# Altium schematic sheet RBB_MCU7_V2.2_MCU.SchDoc: <Project Name>
size A3; ApprovedBy: <Appr.>; Author: <Author>; CompanyName: Infineon Technologies AG; Engineer: <Rel.>; Organization: Infineon Technologies AG; Address1: IFAG DES S PS; Address2: Am Campeon 1-12  -  85579 Neubiberg  -  Germany; Address3: 85579 Neubiberg; Address4: Germany; Revision: <Rev.>; SheetNumber: 3; SheetTotal: 4; Release: RC00; PageSetup: Record=PageOptions|CenterHorizontal=True|CenterVertical=True|PrintScale=1.01|XCorrection=1.00|YCorrection=1.00|PrintKind=0|BorderSize=5000000|LeftOffset=0|BottomOffset=0|Orientation=2|PaperLength=1000|PaperWidth=1000|Scale=100|PaperSource=7|PrintQuality=-4|MediaType=1|DitherType=10|PaperKind=A3|PrintScaleMode=1; Doc_ConfidentialStatus: <Doc_ConfidentialStatus>; Doc_Preliminary: <Doc_Preliminary>
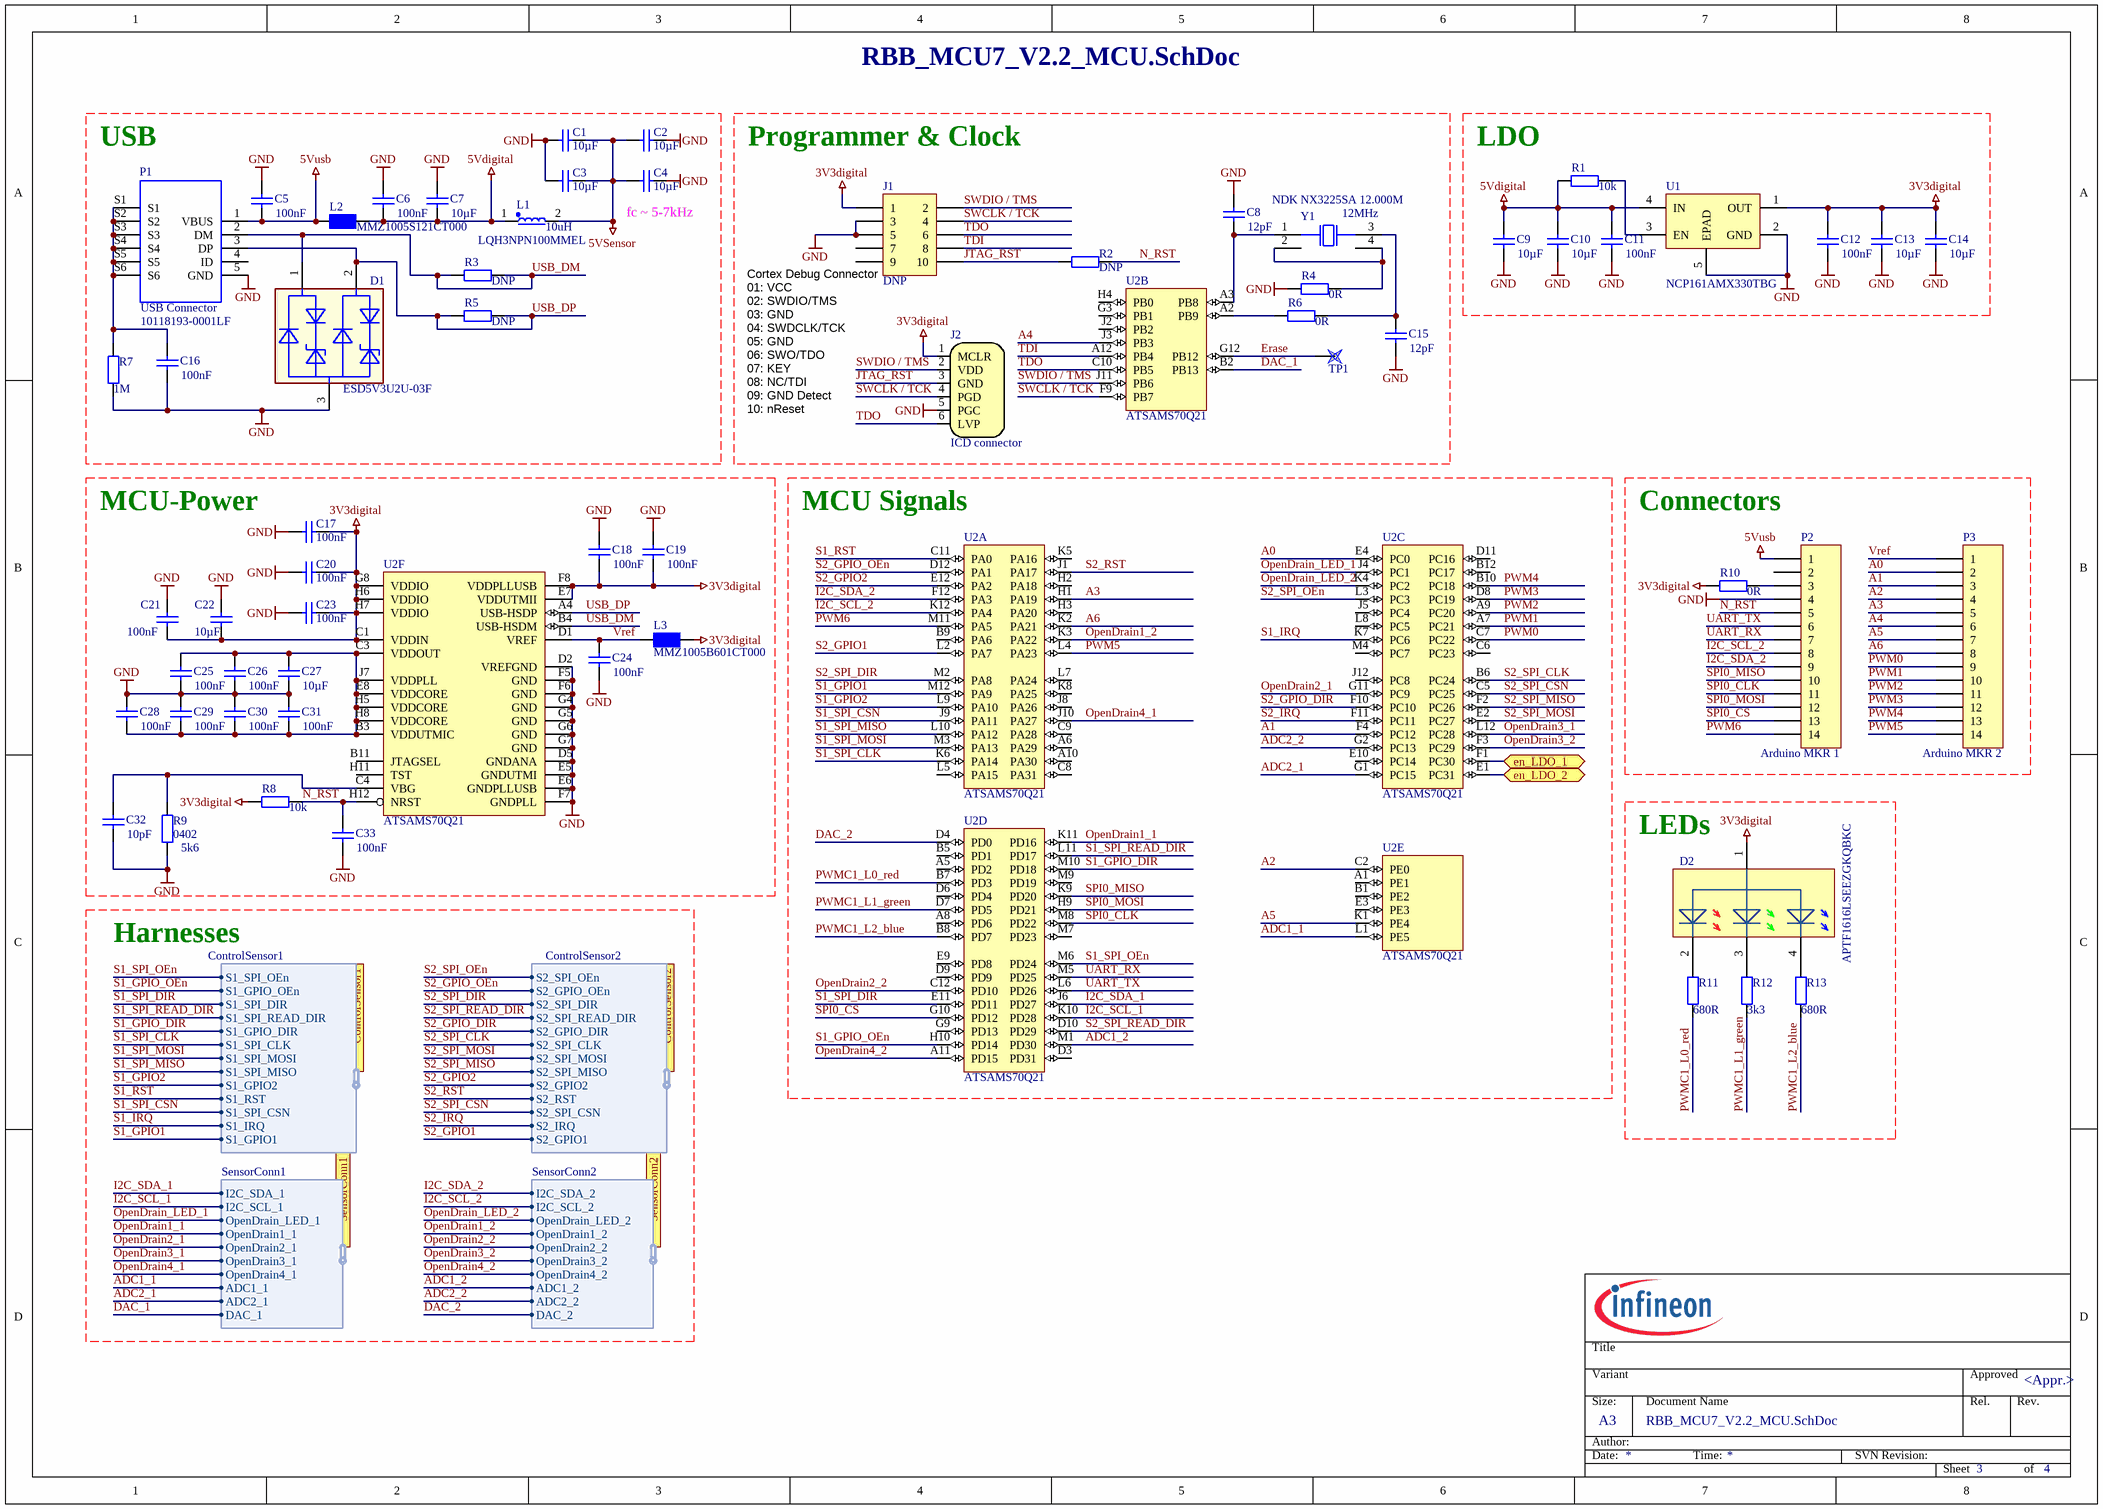
[diagram p0: RBB_MCU7_V2.2_MCU.SchDoc]

## Parts
C1  10µF  [0402_C_Axon]
C2  10µF  [0402_C_Axon]
C3  10µF  [0402_C_Axon]
C4  10µF  [0402_C_Axon]
C5  100nF  [0402_C_Axon]
C6  100nF  [0402_C_Axon]
C7  10µF  [0402_C_Axon]
C8  12pF  [0402_C_Axon]
C9  10µF  [0402_C_Axon]
C10  10µF  [0402_C_Axon]
C11  100nF  [0402_C_Axon]
C12  100nF  [0402_C_Axon]
C13  10µF  [0402_C_Axon]
C14  10µF  [0402_C_Axon]
C15  12pF  [0402_C_Axon]
C16  100nF  [0402_C_Axon]
C17  100nF  [0402_C_Axon]
C18  100nF  [0402_C_Axon]
C19  100nF  [0402_C_Axon]
C20  100nF  [0402_C_Axon]
C21  100nF  [0402_C_Axon]
C22  10µF  [0402_C_Axon]
C23  100nF  [0402_C_Axon]
C24  100nF  [0402_C_Axon]
C25  100nF  [0402_C_Axon]
C26  100nF  [0402_C_Axon]
C27  10µF  [0402_C_Axon]
C28  100nF  [0402_C_Axon]
C29  100nF  [0402_C_Axon]
C30  100nF  [0402_C_Axon]
C31  100nF  [0402_C_Axon]
C32  10pF  [0402_C_Axon]
C33  100nF  [0402_C_Axon]
D1  ESD5V3U2U-03F  [SOTFL40P120X59-3N-V]
D2  APTF1616LSEEZGKQBKC  [APTF1616LSEEZGKQBKC]
J1  DNP  [Samtec FTSH-105-01-L-DV-K - no3D]
J2  value ICD connector  [TC2030-MCP-NL]  (hidden comment: DNP)  (no BOM)
L1  LQH3NPN100MMEL  value 10uH  [INDC3030X150N_LQH3NP_MR]
L2  MMZ1005S121CT000  [0402_L_Axon]
L3  MMZ1005B601CT000  [0402_L_Axon]
P1  10118193-0001LF  value USB Connector  [CON_FCI_10118193]
P2  value Arduino MKR 1  [HDR1X14TOPBOTTOM]  (hidden comment: DNP)
P3  value Arduino MKR 2  [HDR1X14TOPBOTTOM]  (hidden comment: DNP)
R1  10k  [0402_R_Axon]
R2  DNP  [0402_Empty_Axon]
R3  DNP  [0402_Empty_Axon]
R4  0R  [0402_R_Axon]
R5  DNP  [0402_Empty_Axon]
R6  0R  [0402_R_Axon]
R7  1M  [0402_R_Axon]
R8  10k  [0402_R_Axon]
R9  5k6  value 0402  [0402_R_Axon]
R10  0R  [0402_R_Axon]
R11  680R  [0402_R_Axon]
R12  3k3  [0402_R_Axon]
R13  680R  [0402_R_Axon]
TP1  Testpoint  [TP1.5MM]  (value not drawn)  (no BOM)
U1  NCP161AMX330TBG  [NCP163]
U2  ATSAMS70Q21  [LFBGA144]  (parts A,B,C,D,E,F of 6)
Y1  12MHz  Legacy DeviceID: NDK NX3225SA 12.000M  [XTAL-SMD-NX3225SA]

## Ports
ControlSensor1 (harness ControlSensor1), ControlSensor2 (harness ControlSensor2), en_LDO_1 (bidir), en_LDO_2 (bidir), SensorConn1 (harness SensorConn1), SensorConn2 (harness SensorConn2)

## Harnesses
ControlSensor1: S1_SPI_CLK, S1_SPI_MOSI, S1_SPI_MISO, S1_GPIO2, S1_RST, S1_SPI_CSN, S1_IRQ, S1_GPIO1, S1_SPI_OEn, S1_GPIO_OEn, S1_SPI_DIR, S1_SPI_READ_DIR, S1_GPIO_DIR
SensorConn1: I2C_SDA_1, I2C_SCL_1, OpenDrain_LED_1, OpenDrain1_1, OpenDrain2_1, OpenDrain3_1, OpenDrain4_1, ADC1_1, ADC2_1, DAC_1
SensorConn2: I2C_SDA_2, I2C_SCL_2, OpenDrain_LED_2, OpenDrain1_2, OpenDrain2_2, OpenDrain3_2, OpenDrain4_2, ADC1_2, ADC2_2, DAC_2
ControlSensor2: S2_SPI_CLK, S2_SPI_MOSI, S2_SPI_MISO, S2_GPIO2, S2_RST, S2_SPI_CSN, S2_IRQ, S2_GPIO1, S2_SPI_OEn, S2_GPIO_OEn, S2_SPI_DIR, S2_SPI_READ_DIR, S2_GPIO_DIR

## Nets
3V3digital: C12.2 C13.2 C14.2 C17.1 C18.1 C19.1 C20.1 C21.1 C22.1 C23.1 D2.1 J1.1 J2.1(MCLR) L3.1 R8.1 R10.2 U1.1(OUT) U2.C1(VDDIN) U2.E7(VDDUTMII) U2.F8(VDDPLLUSB) U2.G8(VDDIO) U2.H6(VDDIO) U2.H7(VDDIO)
5Vdigital: C6.2 C7.2 C9.2 C10.2 C11.2 L1.1 L2.2 R1.2 U1.4(IN)
5VSensor: C1.2 C2.2 C3.2 C4.2 L1.2
5Vusb: C5.2 L2.1 P1.1(VBUS) P2.1
GND: C1.1 C2.1 C3.1 C4.1 C5.1 C6.1 C7.1 C8.1 C9.1 C10.1 C11.1 C12.1 C13.1 C14.1 C15.2 C16.2 C17.2 C18.2 C19.2 C20.2 C21.2 C22.2 C23.2 C24.1 C25.1 C26.1 C27.2 C28.2 C29.2 C30.2 C31.2 C32.1 C33.1 D1.3 J1.3 J1.5 J2.5(PGC) P1.5(GND) P2.4 R4.2 R7.1 R9.2 U1.2(GND) U1.5(EPAD) U2.D2(VREFGND) U2.D5(GNDANA) U2.E5(GNDUTMI) U2.E6(GNDPLLUSB) U2.F5(GND) U2.F6(GND) U2.F7(GNDPLL) U2.G4(GND) U2.G5(GND) U2.G6(GND) U2.G7(GND)
A0: P3.2 U2.E4(PC0)
A1: P3.3 U2.F4(PC12)
A2: P3.4 U2.C2(PE0)
A3: P3.5 U2.H1(PA19)
A4: P3.6 U2.J3(PB3)
A5: P3.7 U2.K1(PE4)
A6: P3.8 U2.K2(PA21)
ADC1_1: U2.L1(PE5) ; port SensorConn1.ADC1_1
ADC1_2: U2.M1(PD30) ; port SensorConn2.ADC1_2
ADC2_1: U2.G1(PC15) ; port SensorConn1.ADC2_1
ADC2_2: U2.G2(PC13) ; port SensorConn2.ADC2_2
DAC_1: U2.B2(PB13) ; port SensorConn1.DAC_1
DAC_2: U2.D4(PD0) ; port SensorConn2.DAC_2
en_LDO_1: U2.F1(PC30) ; port en_LDO_1
en_LDO_2: U2.E1(PC31) ; port en_LDO_2
Erase: TP1.1 U2.G12(PB12)
I2C_SCL_1: U2.K10(PD28) ; port SensorConn1.I2C_SCL_1
I2C_SCL_2: P2.8 U2.K12(PA4) ; port SensorConn2.I2C_SCL_2
I2C_SDA_1: U2.J6(PD27) ; port SensorConn1.I2C_SDA_1
I2C_SDA_2: P2.9 U2.F12(PA3) ; port SensorConn2.I2C_SDA_2
JTAG_RST: J1.10 J2.3(GND) R2.2
N_RST: C33.2 P2.5 R2.1 R8.2 U2.H12(NRST)
OpenDrain1_1: U2.K11(PD16) ; port SensorConn1.OpenDrain1_1
OpenDrain1_2: U2.K3(PA22) ; port SensorConn2.OpenDrain1_2
OpenDrain2_1: U2.G11(PC9) ; port SensorConn1.OpenDrain2_1
OpenDrain2_2: U2.C12(PD10) ; port SensorConn2.OpenDrain2_2
OpenDrain3_1: U2.L12(PC28) ; port SensorConn1.OpenDrain3_1
OpenDrain3_2: U2.F3(PC29) ; port SensorConn2.OpenDrain3_2
OpenDrain4_1: U2.J10(PA27) ; port SensorConn1.OpenDrain4_1
OpenDrain4_2: U2.A11(PD15) ; port SensorConn2.OpenDrain4_2
OpenDrain_LED_1: U2.J4(PC1) ; port SensorConn1.OpenDrain_LED_1
OpenDrain_LED_2: U2.K4(PC2) ; port SensorConn2.OpenDrain_LED_2
PWM0: P3.9 U2.C7(PC22)
PWM1: P3.10 U2.A7(PC21)
PWM2: P3.11 U2.A9(PC20)
PWM3: P3.12 U2.D8(PC19)
PWM4: P3.13 U2.B10(PC18)
PWM5: P3.14 U2.L4(PA23)
PWM6: P2.14 U2.M11(PA5)
PWMC1_L0_red: R11.1 U2.B7(PD3)
PWMC1_L1_green: R12.1 U2.D7(PD5)
PWMC1_L2_blue: R13.1 U2.B8(PD7)
S1_GPIO1: U2.M12(PA9) ; port ControlSensor1.S1_GPIO1
S1_GPIO2: U2.L9(PA10) ; port ControlSensor1.S1_GPIO2
S1_GPIO_DIR: U2.M10(PD18) ; port ControlSensor1.S1_GPIO_DIR
S1_GPIO_OEn: U2.H10(PD14) ; port ControlSensor1.S1_GPIO_OEn
S1_IRQ: U2.K7(PC6) ; port ControlSensor1.S1_IRQ
S1_RST: U2.C11(PA0) ; port ControlSensor1.S1_RST
S1_SPI_CLK: U2.K6(PA14) ; port ControlSensor1.S1_SPI_CLK
S1_SPI_CSN: U2.J9(PA11) ; port ControlSensor1.S1_SPI_CSN
S1_SPI_DIR: U2.E11(PD11) ; port ControlSensor1.S1_SPI_DIR
S1_SPI_MISO: U2.L10(PA12) ; port ControlSensor1.S1_SPI_MISO
S1_SPI_MOSI: U2.M3(PA13) ; port ControlSensor1.S1_SPI_MOSI
S1_SPI_OEn: U2.M6(PD24) ; port ControlSensor1.S1_SPI_OEn
S1_SPI_READ_DIR: U2.L11(PD17) ; port ControlSensor1.S1_SPI_READ_DIR
S2_GPIO1: U2.L2(PA7) ; port ControlSensor2.S2_GPIO1
S2_GPIO2: U2.E12(PA2) ; port ControlSensor2.S2_GPIO2
S2_GPIO_DIR: U2.F10(PC10) ; port ControlSensor2.S2_GPIO_DIR
S2_GPIO_OEn: U2.D12(PA1) ; port ControlSensor2.S2_GPIO_OEn
S2_IRQ: U2.F11(PC11) ; port ControlSensor2.S2_IRQ
S2_RST: U2.J1(PA17) ; port ControlSensor2.S2_RST
S2_SPI_CLK: U2.B6(PC24) ; port ControlSensor2.S2_SPI_CLK
S2_SPI_CSN: U2.C5(PC25) ; port ControlSensor2.S2_SPI_CSN
S2_SPI_DIR: U2.M2(PA8) ; port ControlSensor2.S2_SPI_DIR
S2_SPI_MISO: U2.F2(PC26) ; port ControlSensor2.S2_SPI_MISO
S2_SPI_MOSI: U2.E2(PC27) ; port ControlSensor2.S2_SPI_MOSI
S2_SPI_OEn: U2.L3(PC3) ; port ControlSensor2.S2_SPI_OEn
S2_SPI_READ_DIR: U2.D10(PD29) ; port ControlSensor2.S2_SPI_READ_DIR
SPI0_CLK: P2.11 U2.M8(PD22)
SPI0_CS: P2.13 U2.G10(PD12)
SPI0_MISO: P2.10 U2.K9(PD20)
SPI0_MOSI: P2.12 U2.H9(PD21)
SWCLK / TCK: J1.4 J2.4(PGD) U2.F9(PB7)
SWDIO / TMS: J1.2 J2.2(VDD) U2.J11(PB6)
TDI: J1.8 U2.A12(PB4)
TDO: J1.6 J2.6(LVP) U2.C10(PB5)
UART_RX: P2.7 U2.M5(PD25)
UART_TX: P2.6 U2.L6(PD26)
USB_DM: D1.1 P1.2(DM) R3.1 R3.2 U2.B4(USB-HSDM)
USB_DP: D1.2 P1.3(DP) R5.1 R5.2 U2.A4(USB-HSDP)
Vref: C24.2 L3.2 P3.1 U2.D1(VREF)
NetC8_2: C8.2 U2.A3(PB8) Y1.1
NetC15_1: C15.1 R6.1 Y1.3
NetC16_1: C16.1 P1.S1 P1.S2 P1.S3 P1.S4 P1.S5 P1.S6 R7.2
NetC25_2: C25.2 C26.2 C27.1 C28.1 C29.1 C30.1 C31.1 U2.B3(VDDUTMIC) U2.C3(VDDOUT) U2.E8(VDDCORE) U2.H5(VDDCORE) U2.H8(VDDCORE) U2.J7(VDDPLL)
NetC32_2: C32.2 R9.1 U2.C4(VBG)
NetD2_2: D2.2 R11.2
NetD2_3: D2.3 R12.2
NetD2_4: D2.4 R13.2
NetP2_3: P2.3 R10.1
NetR1_1: R1.1 U1.3(EN)
NetR4_1: R4.1 Y1.2 Y1.4
NetR6_2: R6.2 U2.A2(PB9)

Not connected (* = marked no-connect by the designer): J1 7 9; P1 4(ID); P2 2; U2 A1(PE1) A5(PD2) A6(PA29) A8(PD6) A10(PA30) B1(PE2) B5(PD1) B9(PA6) B11(JTAGSEL) B12(PC17) C6(PC23) C8(PA31) C9(PA28) D3(PD31) D6(PD4) D9(PD9) D11(PC16) E3(PE3) E9(PD8) E10(PC14) G3(PB1) G9(PD13) H2(PA18) H3(PA20) H4(PB0) H11(TST) J2(PB2) J5(PC4) J8(PA26) J12(PC8) K5(PA16) K8(PA25) L5(PA15) L7(PA24) L8(PC5) M4(PC7) M7(PD23) M9(PD19)

## Notes on the sheet
- USB
- Programmer & Clock
- LDO
- (near C4) fc ~ 5-7kHz
- (near J1) Cortex Debug Connector
- 01: VCC
- 02: SWDIO/TMS
- 03: GND
- 04: SWDCLK/TCK
- 05: GND
- 06: SWO/TDO
- 07: KEY
- 08: NC/TDI
- 09: GND Detect
- 10: nReset
- MCU-Power
- MCU Signals
- Connectors
- (near D2) LEDs
- Harnesses
- Title
- Variant
- Approved
- Date:
- Author:
- Size:
- A3
- Document Name
- Time:
- SVN Revision:
- Rel.
- Rev.
- Sheet
- of

## Library data of the parts
C1-C33 = Cap: Capacitor; Value: 0402; Published: 8-Jun-2000; LatestRevisionDate: 17-Jul-2002; LatestRevisionNote: Re-released for DXP Platform.; PackageReference: RAD-0.3; Publisher: Altium Limited; PackageDescription: Radial Cap, Thru-Hole; 2 Leads; 0.3 in Pin Spacing
D1 = 427307: Ultra-Low ESD / Transient Protection Diode, Uni-Directional, VRWM 5.3V; Legacy PartNumber: IFX01400970; Manufacturer: Infineon Technologies; Manufacturer Component Status: Active; Symbol Type: 2 Lines Uni-directional Transient Voltage Suppressor Diode, 3 Pins; Alternate View: No; Article Number: 427307; Version Number: V01; Combined Parameters: Vf:-;If:-;Ur:5.3V;Ir:50nA;Pmax:-; Type: TVS Diode; Style: Single; ComponentStatus: Released; Second Source allowed: Yes; Multiple Part: No; Legacy DeviceID: IFX01400970; Part Type: Diode; Manufacturer Order Number: ESD5V3U2U-03F; Value: ESD5V3U2U-03F; Application: Protection; Temperature min: -40; Temperature max: 125; Temperature Range: Automotive; RoHS Compliant: Y; Automotive Qualified: No; PackageReference: TSFP-3-1; ComponentLink1Description: Vendor WebSite; ComponentLink1URL: https://www.infineon.com/; ComponentLink2Description: Datasheet; ComponentLink2URL: http://webnetprod.muc.infineon.com/pcbportal_prod/WorkFlows/AltiumComponent/StandardDocumentation?Versionid=427308; Supplier 1: Farnell; Supplier 2: DigiKey; Supplier Part Number 2: ESD5V3U2U03FH6327XTSA1TR-ND; Supplier 3: Mouser; Supplier Part Number 3: 726-5V3U2U03FH6327XT
D2 = APTF1616LSEEZGKQBKC: Kingbright - APTF1616LSEEZGKQBKC
J1 = Header 5X2: Header, 5-Pin, Dual row, SMD; Bestellnummer: FTSH-105-01-L-DV-K; Hersteller: Samtec; Notes: without Pin 7; Preis: 1.525; Distributor: Samtec; FootprintBOM: SMD; Kleinmengendistributor: Samtec; KleinmengendistributorBestellnummer: FTSH-105-01-L-DV-K
J2 = TC2030-MCP-NL: Conector par ICD
L1 = 316693: for Power Line; Multiple Parts: No; Legacy PartNumber: IND00700877; Manufacturer: muRata; Manufacturer Order Number: LQH3NPN100MMR; Manufacturer Component Status: Active; Symbol Type: Inductor; Single; Standard; Polarized; Core; 2 Pins; Alternate View: Yes; Article Number: 316693; Version Number: V01; Tolerance Neg: 20%; Combined Parameters: Tol.:-20%/+20%;Rdc:252mR;Idc:1.15A;Fres:30MHz; Style: Single; Voltage DC (max): na; Legacy DeviceID: IND00700877; Part Type: Inductor; Tolerance Pos: 20%; Type: LQH3NPN100MMEL; Technology: Wire Wound; Temperature min: -40; Temperature max: 85; Temperature Range: Industrial; RoHS Compliant: Y; Automotive Qualified: No; PackageReference: 3030 (1212); ComponentLink1Description: Vendor WebSite; ComponentLink1URL: http://www.murata.com; ComponentLink2Description: Datasheet; ComponentLink2URL: http://webnetprod.muc.infineon.com/pcbportal_prod/WorkFlows/AltiumComponent/StandardDocumentation?Versionid=316694; Supplier 1: Farnell; Supplier 2: DigiKey; Supplier 3: Mouser; PLMStatus: Active; Second Source allowed: Yes; Package Description: Inductor,Chip;3.00mm L X 3.00mm W X 1.50mm H
L2 L3 = INDUCTOR1: SMD Ferrite Bead; Preis: 0; Hersteller: Würth; FootprintBOM: 0805; Kleinmengendistributor: Digi-Key; KleinmengendistributorBestellnummer: 732-1601-1-ND
P1 = FCI_10118193: USB Micro B Receptacle, Right Angle, SMD w/2 DIP Legs; Manufacturer: FCI; OrderNr: 649-10118193-0001LF; Manufacturer Part Number: 10118193-0001LF; Distributor: Mouser; ManufacturerPartNo: 10118193-0001LF; ManufacturerPartNumber: 10118193-0001LF; PackageDescription: Connector; PackageReference: USB
P2 P3 = Header 14: Header, 14-Pin; LatestRevisionDate: 17-Jul-2002; LatestRevisionNote: Re-released for DXP Platform.; Publisher: Altium Limited
R1-R8 R10-R13 = Res2: Resistor; Value: 0402
R9 = Res2: Resistor
TP1 = P_PRUEFPAD: FootprintBOM: Testpoint; Preis: -
U1 = NCP177: NCP161 - LDO 450mA, XDFN4 / ultra-low noise, high PSRR
Y1 = 409657: SMD Crystal Unit for Automotive Application, 12.000MHz; Legacy PartNumber: IC02600619; Manufacturer: Nihon Dempa Kogyo; Manufacturer Order Number: NX3225SA-12.000M-STD-CRS-2; Manufacturer Component Status: Active; Symbol type: Standard Crystal Symbol, 4 Pins; Article Number: 409657; Version Number: V01; Tolerance Neg: 50%; Combined Parameters: Standard Standard Crystal;Tol.:-50%/+50%; Style: Standard; Automotive Qualified: AEC Q200; ComponentStatus: Released; Second Source allowed: Yes; Part Type: Clock; Value: 12MHz; Tolerance Pos: 50%; Type: Crystal; Application: Standard; Temperature min: -40; Temperature max: 125; Temperature Range: Automotive; RoHS Compliant: Y; PackageReference: SMD 3.2 x 2.5 x 0.6mm; ComponentLink1Description: Vendor WebSite; ComponentLink1URL: http://www.ndk.com/en/; ComponentLink2Description: Datasheet; ComponentLink2URL: http://webnetprod.muc.infineon.com/pcbportal_prod/WorkFlows/AltiumComponent/StandardDocumentation?Versionid=409658; Supplier 1: Farnell; Supplier 2: DigiKey; Supplier Part Number 2: 644-1128-2-ND; Supplier 3: Mouser
U2 = ATSAMS70Q21: Value: ATSAMS70Q21